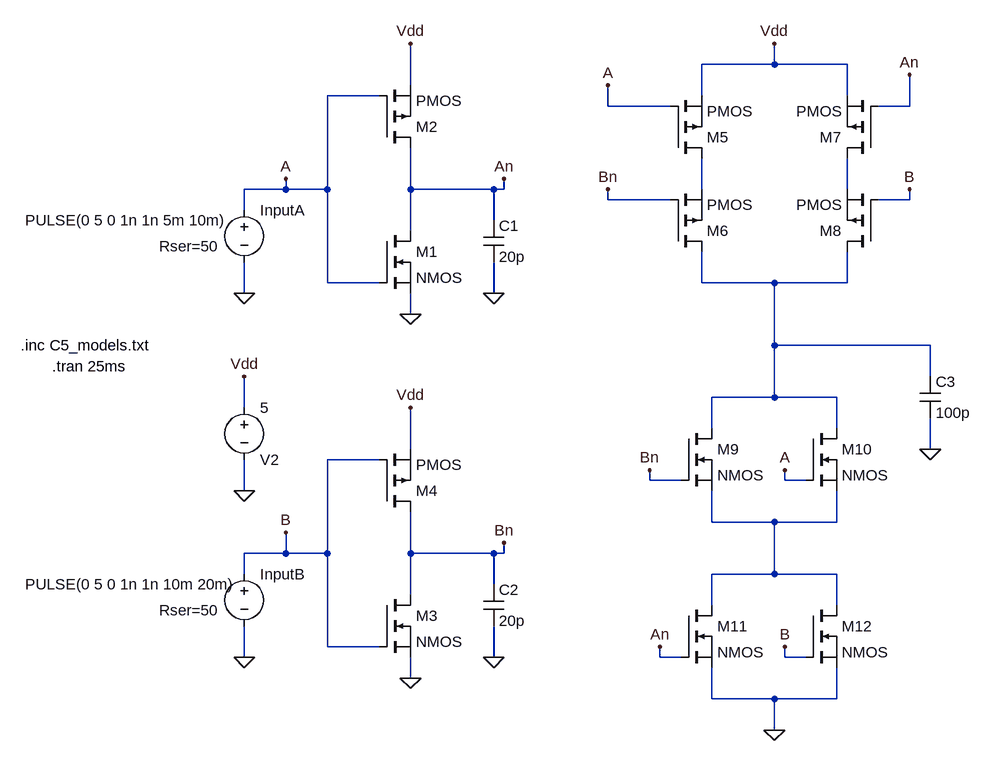
[diagram p0: schematic XOR.asc]
XOR.asc, the LTspice schematic file:
Version 4
SHEET 1 1340 2276
WIRE 848 64 848 32
WIRE 848 64 736 64
WIRE 960 64 848 64
WIRE 288 96 288 32
WIRE 240 112 160 112
WIRE 736 112 736 64
WIRE 960 112 960 64
WIRE 592 128 592 96
WIRE 688 128 592 128
WIRE 1056 128 1056 80
WIRE 1056 128 1008 128
WIRE 96 256 96 240
WIRE 96 256 32 256
WIRE 160 256 160 112
WIRE 160 256 96 256
WIRE 288 256 288 192
WIRE 416 256 288 256
WIRE 432 256 432 240
WIRE 432 256 416 256
WIRE 736 256 736 208
WIRE 960 256 960 208
WIRE 592 272 592 256
WIRE 688 272 592 272
WIRE 1056 272 1056 256
WIRE 1056 272 1008 272
WIRE 32 288 32 256
WIRE 416 304 416 256
WIRE 288 320 288 256
WIRE 160 400 160 256
WIRE 240 400 160 400
WIRE 736 400 736 352
WIRE 848 400 736 400
WIRE 960 400 960 352
WIRE 960 400 848 400
WIRE 32 416 32 368
WIRE 416 416 416 368
WIRE 288 448 288 416
WIRE 848 496 848 400
WIRE 1088 496 848 496
WIRE 1088 544 1088 496
WIRE 848 576 848 496
WIRE 848 576 752 576
WIRE 944 576 848 576
WIRE 32 592 32 544
WIRE 752 624 752 576
WIRE 944 624 944 576
WIRE 288 656 288 592
WIRE 1088 656 1088 608
WIRE 240 672 160 672
WIRE 656 704 656 688
WIRE 704 704 656 704
WIRE 864 704 864 688
WIRE 896 704 864 704
WIRE 32 720 32 672
WIRE 752 768 752 720
WIRE 848 768 752 768
WIRE 944 768 944 720
WIRE 944 768 848 768
WIRE 96 816 96 784
WIRE 96 816 32 816
WIRE 160 816 160 672
WIRE 160 816 96 816
WIRE 288 816 288 752
WIRE 416 816 288 816
WIRE 432 816 432 800
WIRE 432 816 416 816
WIRE 32 848 32 816
WIRE 848 848 848 768
WIRE 848 848 752 848
WIRE 944 848 848 848
WIRE 416 864 416 816
WIRE 288 880 288 816
WIRE 752 896 752 848
WIRE 944 896 944 848
WIRE 160 960 160 816
WIRE 240 960 160 960
WIRE 32 976 32 928
WIRE 416 976 416 928
WIRE 672 976 672 960
WIRE 704 976 672 976
WIRE 864 976 864 960
WIRE 896 976 864 976
WIRE 288 1008 288 976
WIRE 752 1040 752 992
WIRE 848 1040 752 1040
WIRE 944 1040 944 992
WIRE 944 1040 848 1040
WIRE 848 1088 848 1040
FLAG 416 416 0
FLAG 288 448 0
FLAG 32 416 0
FLAG 32 720 0
FLAG 32 544 Vdd
FLAG 288 32 Vdd
FLAG 416 976 0
FLAG 288 1008 0
FLAG 32 976 0
FLAG 288 592 Vdd
FLAG 432 240 An
FLAG 432 800 Bn
FLAG 96 240 A
FLAG 96 784 B
FLAG 592 96 A
FLAG 592 256 Bn
FLAG 1056 80 An
FLAG 1056 256 B
FLAG 848 32 Vdd
FLAG 656 688 Bn
FLAG 864 688 A
FLAG 672 960 An
FLAG 864 960 B
FLAG 848 1088 0
FLAG 1088 656 0
SYMBOL nmos 240 320 R0
SYMATTR InstName M1
SYMBOL pmos 240 192 M180
SYMATTR InstName M2
SYMBOL cap 400 304 R0
SYMATTR InstName C1
SYMATTR Value 20p
SYMBOL voltage 32 272 R0
WINDOW 3 -337 32 Left 2
WINDOW 123 0 0 Left 2
WINDOW 39 -131 72 Left 2
SYMATTR InstName InputA
SYMATTR Value PULSE(0 5 0 1n 1n 5m 10m)
SYMATTR SpiceLine Rser=50
SYMBOL voltage 32 576 R0
WINDOW 0 24 96 Left 2
WINDOW 3 24 16 Left 2
WINDOW 123 0 0 Left 2
WINDOW 39 0 0 Left 2
SYMATTR InstName V2
SYMATTR Value 5
SYMBOL nmos 240 880 R0
SYMATTR InstName M3
SYMBOL pmos 240 752 M180
SYMATTR InstName M4
SYMBOL cap 400 864 R0
SYMATTR InstName C2
SYMATTR Value 20p
SYMBOL voltage 32 832 R0
WINDOW 3 -337 32 Left 2
WINDOW 123 0 0 Left 2
WINDOW 39 -131 72 Left 2
SYMATTR InstName InputB
SYMATTR Value PULSE(0 5 0 1n 1n 10m 20m)
SYMATTR SpiceLine Rser=50
SYMBOL pmos 688 208 M180
SYMATTR InstName M5
SYMBOL pmos 688 352 M180
SYMATTR InstName M6
SYMBOL pmos 1008 208 R180
SYMATTR InstName M7
SYMBOL pmos 1008 352 R180
SYMATTR InstName M8
SYMBOL nmos 704 624 R0
SYMATTR InstName M9
SYMBOL nmos 896 624 R0
SYMATTR InstName M10
SYMBOL nmos 704 896 R0
SYMATTR InstName M11
SYMBOL nmos 896 896 R0
SYMATTR InstName M12
SYMBOL cap 1072 544 R0
SYMATTR InstName C3
SYMATTR Value 100p
TEXT -264 528 Left 2 !.tran 25ms
TEXT -312 496 Left 2 !.inc C5_models.txt

The netlist it stands for:
* XOR.asc
M1 An A 0 0 NMOS
M2 An A Vdd Vdd PMOS
C1 An 0 20p
V§InputA A 0 PULSE(0 5 0 1n 1n 5m 10m) Rser=50
V2 Vdd 0 5
M3 Bn B 0 0 NMOS
M4 Bn B Vdd Vdd PMOS
C2 Bn 0 20p
V§InputB B 0 PULSE(0 5 0 1n 1n 10m 20m) Rser=50
M5 N001 A Vdd Vdd PMOS
M6 N003 Bn N001 N001 PMOS
M7 N002 An Vdd Vdd PMOS
M8 N003 B N002 N002 PMOS
M9 N003 Bn N004 N004 NMOS
M10 N003 A N004 N004 NMOS
M11 N004 An 0 0 NMOS
M12 N004 B 0 0 NMOS
C3 N003 0 100p
.model NMOS NMOS
.model PMOS PMOS
.lib standard.mos
.tran 25ms
.inc C5_models.txt
.backanno
.end

* Results of the author's LTspice run, read from the files saved beside the schematic
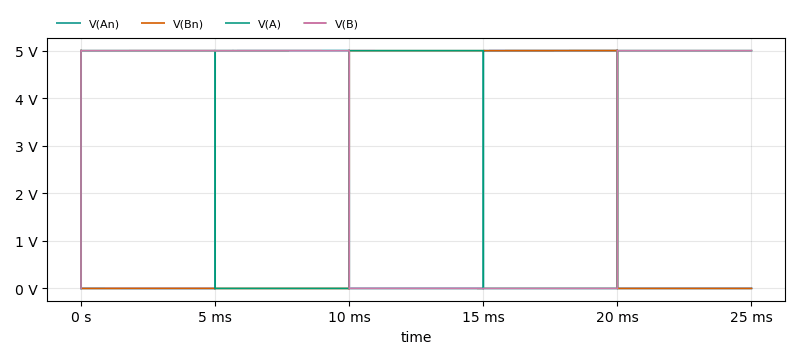
[diagram p1: Transient Analysis of XOR.asc, plotted from the saved traces]
* Transient Analysis, 1 run:
*   V(An): min -8.06 mV, max 5.006 V, average 2 V, rms 3.162 V, last 0 V
*   V(Bn): min -6.351 mV, max 5.006 V, average 2 V, rms 3.162 V, last 0 V
*   V(A): min -34.03 µV, max 5.003 V, average 3 V, rms 3.873 V, last 5 V
*   V(B): min -132.4 µV, max 5.003 V, average 3 V, rms 3.873 V, last 5 V